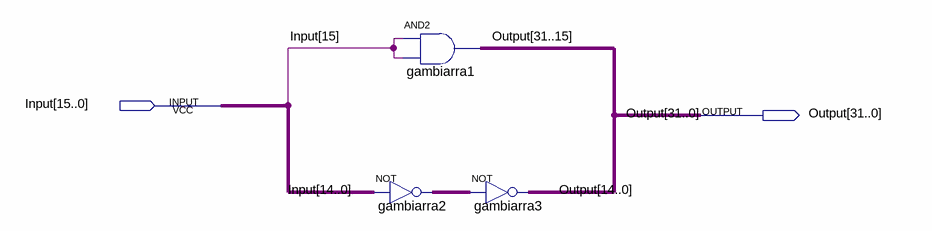
[diagram p0: schematic sheet]
// Quartus schematic signalExtend.bdf as structural Verilog: 3 symbols, 2 pins
module signalExtend (
  input  [15:0] Input,
  output [31:0] Output
);

  wire [14:0] gambiarra2_out;

  assign Output[31:15] = {17{Input[15]}} & {17{Input[15]}};  // AND2 gambiarra1, 17 bits wide
  assign gambiarra2_out = ~Input[14:0];  // NOT gambiarra2, 15 bits wide
  assign Output[14:0] = ~gambiarra2_out;  // NOT gambiarra3, 15 bits wide
endmodule
